# Altium project Tachometer-Board.PrjPcb
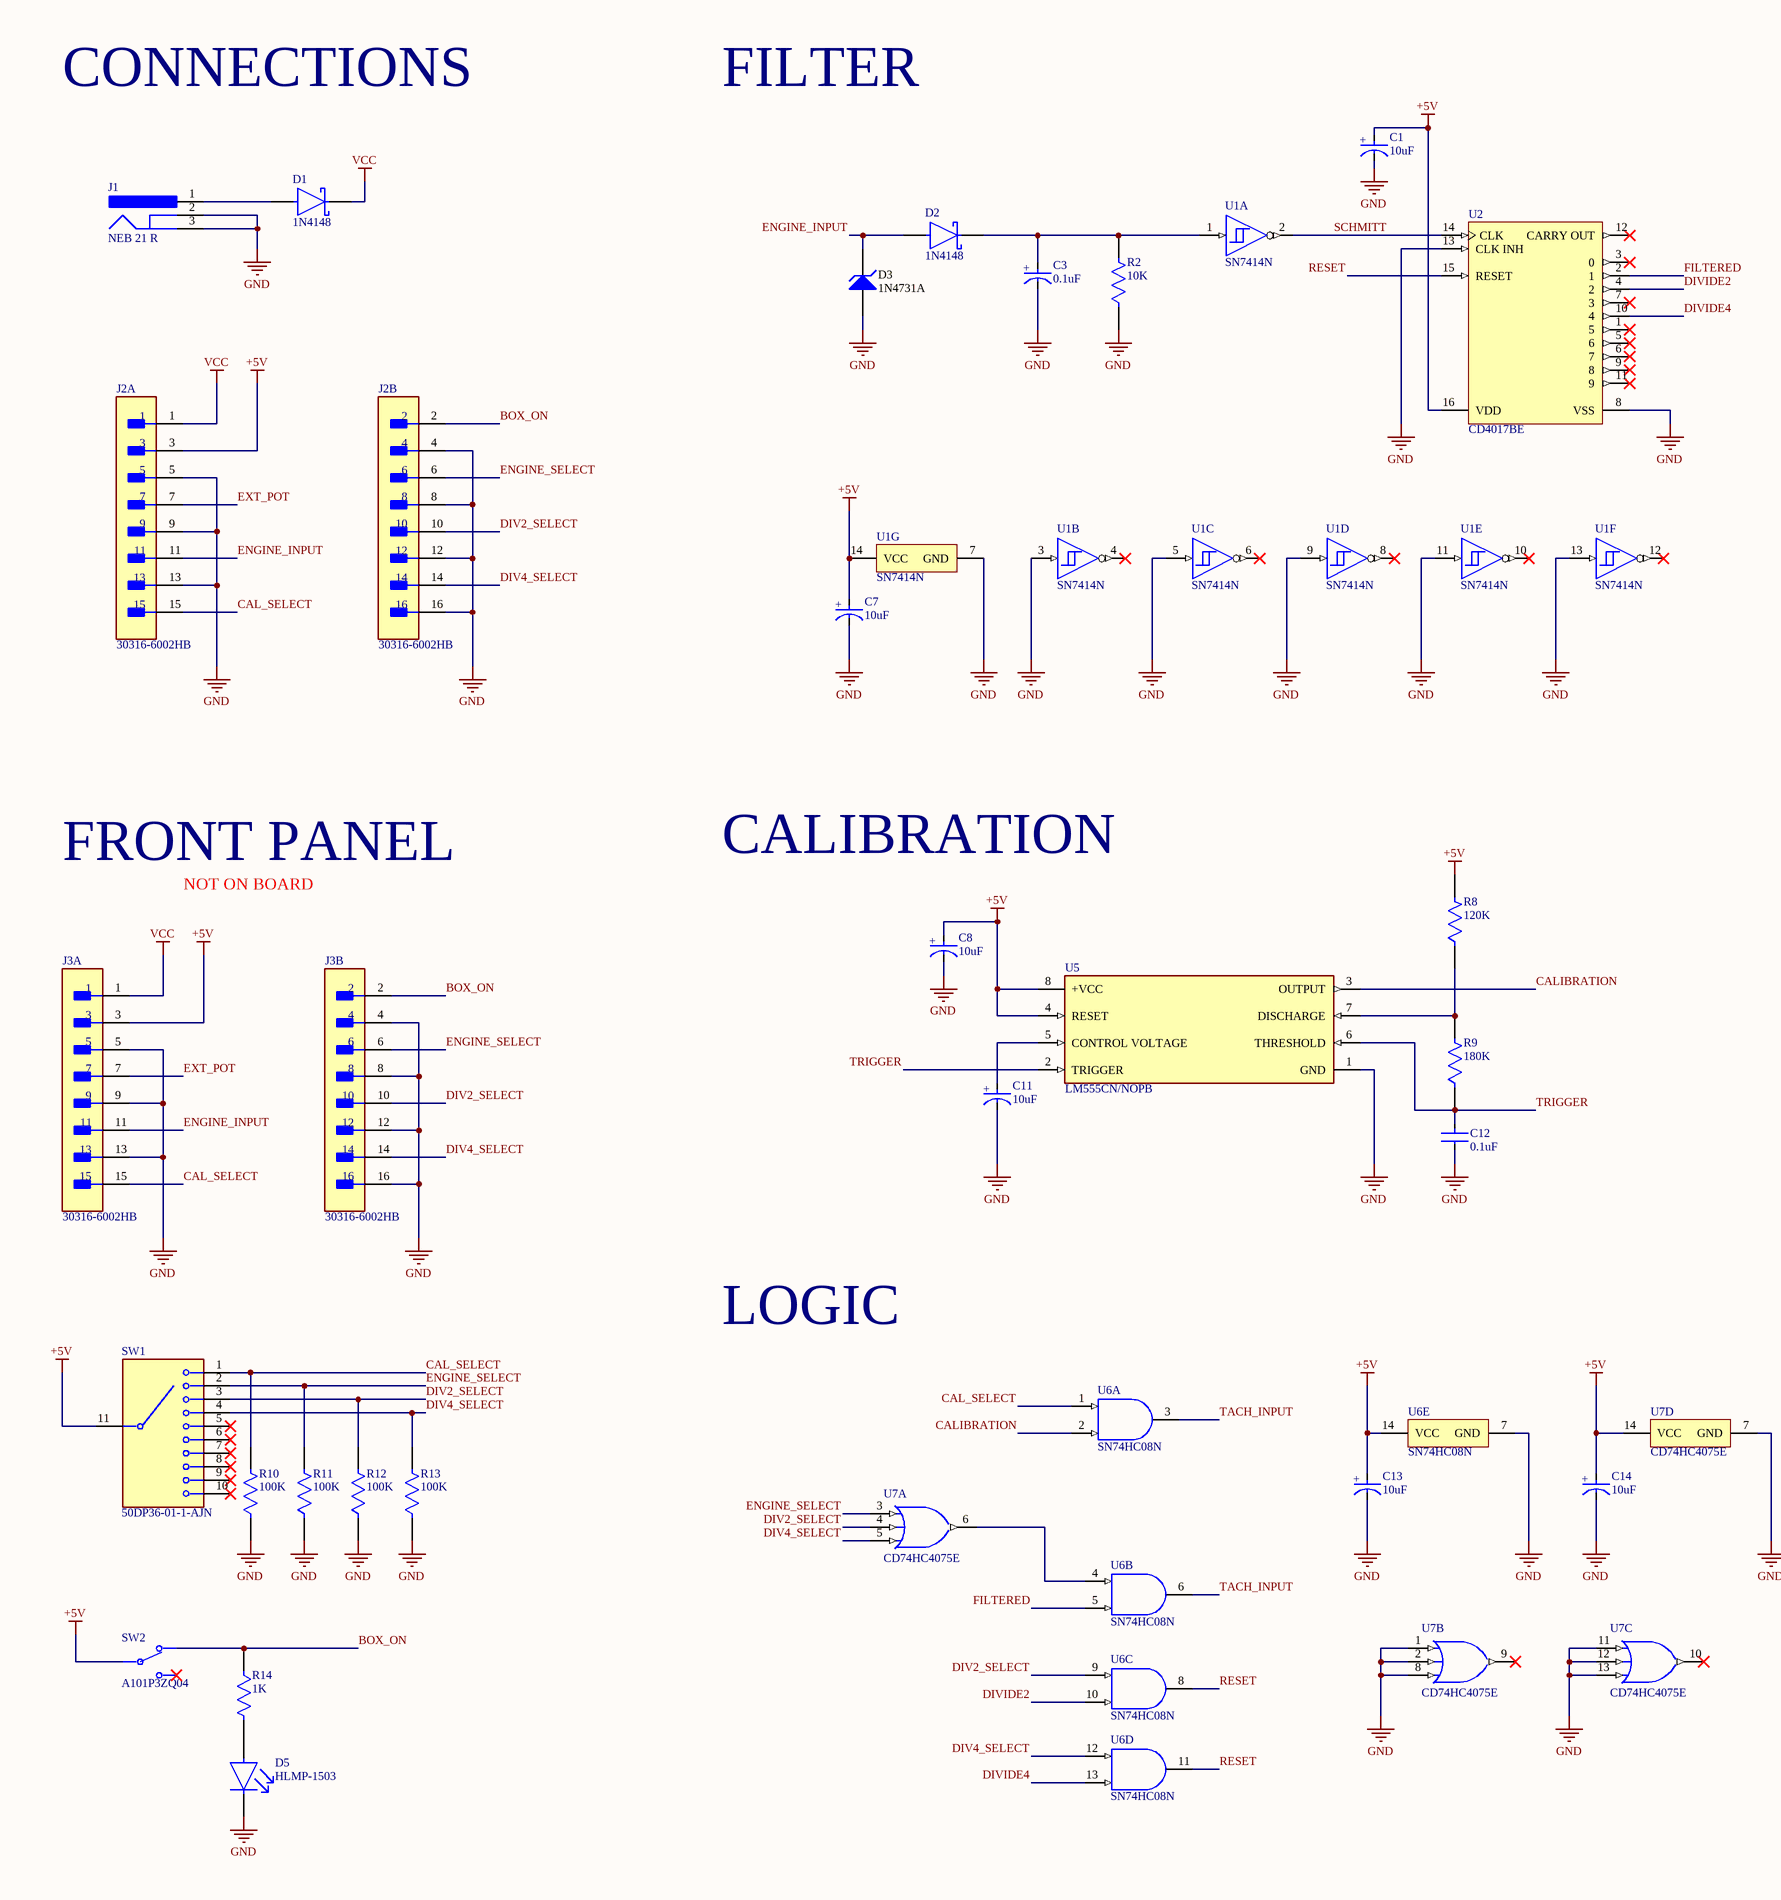
[diagram p0: Tachometer-Board.SchDoc, left]
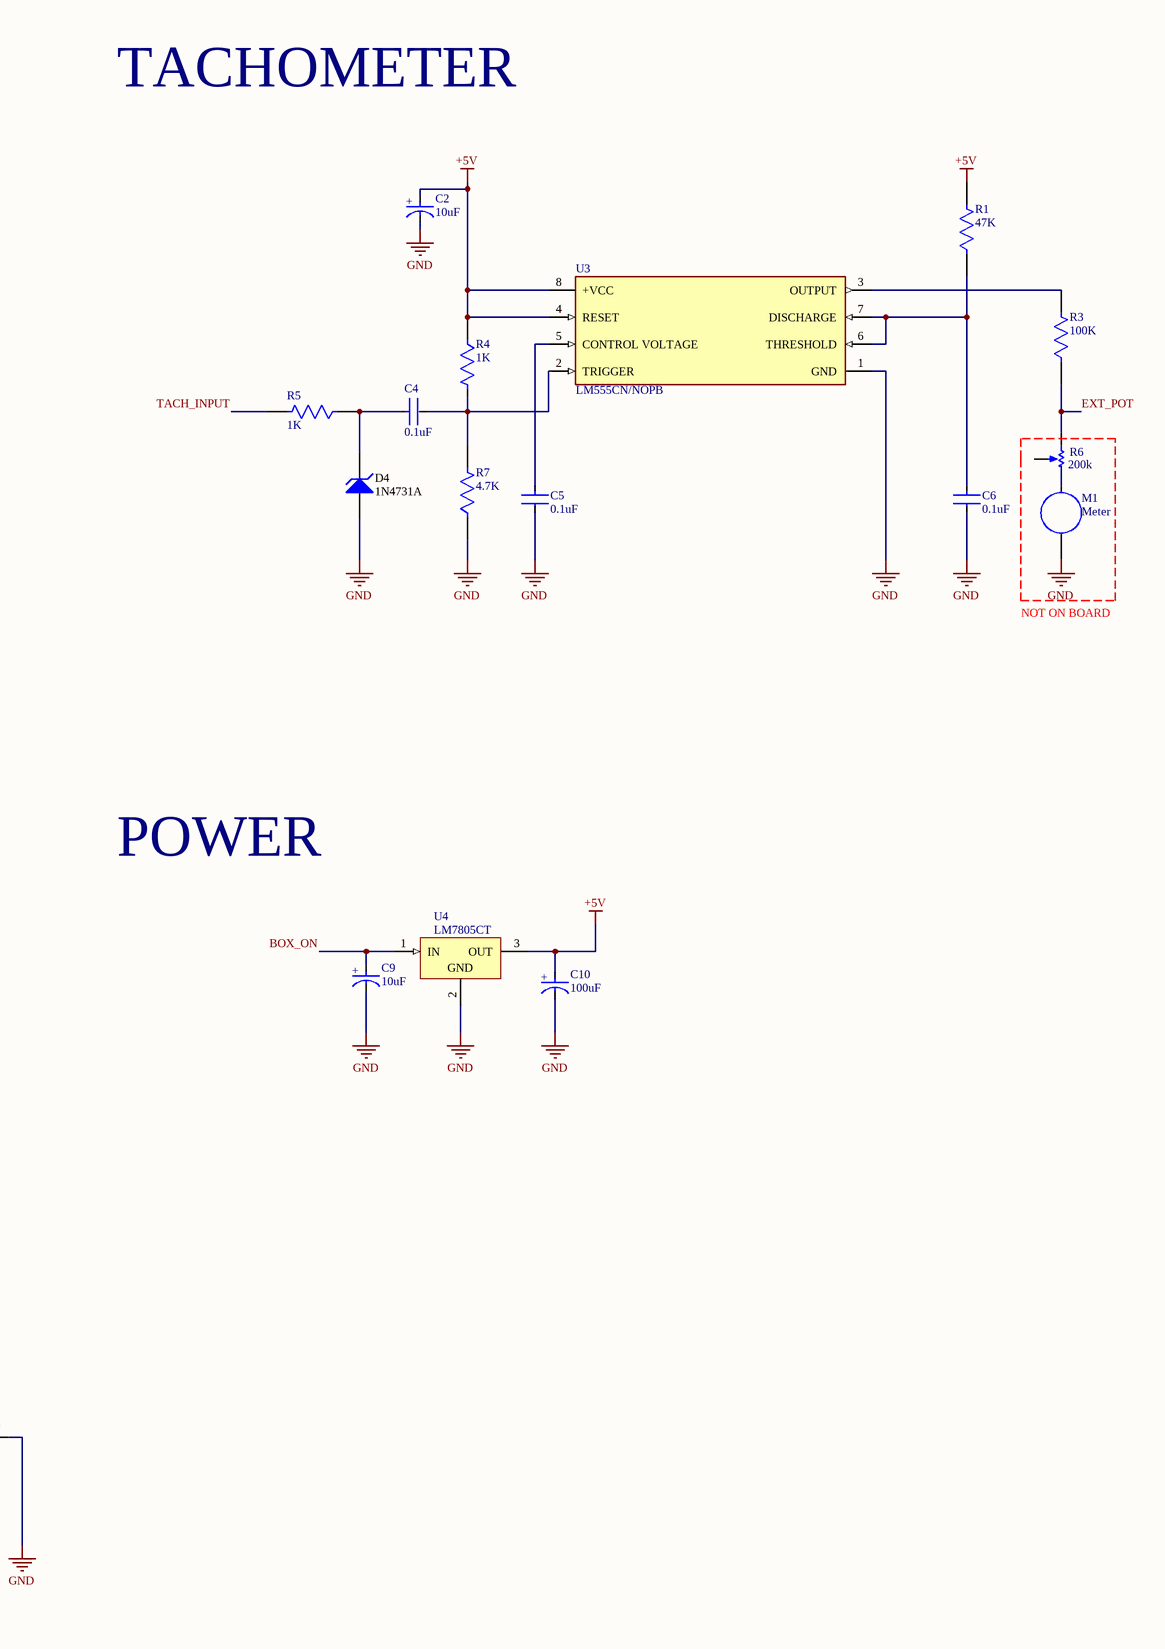
[diagram p1: Tachometer-Board.SchDoc, right]
1 sheet, 46 parts. Net scope: global (net labels, ports and power ports of the same name join across sheets).
Board files: Tachometer-BoardV2.PcbDoc, Tachometer-Board.PcbDoc

## Sheet Tachometer-Board.SchDoc
size A2; SheetNumber: 1; SheetTotal: 1

### Parts
C1  10uF  [FP-ESLE3-MFG]
C2  10uF  [FP-ESLE3-MFG]
C3  0.1uF  [FP-ESLE3-MFG]
C4  0.1uF  [FP-K15H5-MFG]
C5  0.1uF  [FP-K15H5-MFG]
C6  0.1uF  [FP-K15H5-MFG]
C7  10uF  [FP-ESLE3-MFG]
C8  10uF  [FP-ESLE3-MFG]
C9  10uF  [FP-ESLE3-MFG]
C10  100uF  [FP-ZLG6_3X7-MFG]
C11  10uF  [FP-ESLE3-MFG]
C12  0.1uF  [FP-K15H5-MFG]
C13  10uF  [FP-ESLE3-MFG]
C14  10uF  [FP-ESLE3-MFG]
D1  1N4148  [FP-DO-201AD-MFG]
D2  1N4148  [FP-DO-201AD-MFG]
D3  1N4731A  [FAIR-DO-41-2_V]
D4  1N4731A  [FAIR-DO-41-2_V]
D5  HLMP-1503  [FP-HLMP-1503-MFG]  (mechanical)
J1  NEB 21 R  [LUMB-NEB21R_V]
J2  30316-6002HB  [FP-30316-6002HB-MFG]  (parts A,B of 2)
J3  30316-6002HB  [FP-30316-6002HB-MFG]  (parts A,B of 2)  (mechanical)
M1  Meter  [RAD-0.1]  (mechanical)
R1  47K  [FP-MFR-25-MFG]
R2  10K  [FP-MFR-25-MFG]
R3  100K  [FP-MFR-25-MFG]
R4  1K  [FP-MFR-25-MFG]
R5  1K  [FP-MFR-25-MFG]
R6  value 200k  [VR5]  (hidden comment: RPot)  (mechanical)
R7  4.7K  [FP-MFR-25-MFG]
R8  120K  [FP-MFR-25-MFG]
R9  180K  [FP-MFR-25-MFG]
R10  100K  [FP-MFR-25-MFG]  (mechanical)
R11  100K  [FP-MFR-25-MFG]  (mechanical)
R12  100K  [FP-MFR-25-MFG]  (mechanical)
R13  100K  [FP-MFR-25-MFG]  (mechanical)
R14  1K  [FP-MFR-25-MFG]  (mechanical)
SW1  50DP36-01-1-AJN  [FP-50DP36-01-1-AJN-MFG]  (mechanical)
SW2  A101P3ZQ04  [FP-A101P3ZQ04-MFG]  (mechanical)
U1  SN7414N  [N0014A]  (parts A,B,C,D,E,F,G of 7)
U2  CD4017BE  [N0016A]
U3  LM555CN/NOPB  [FP-P0008A-MFG]
U4  LM7805CT  [FAIR-TO-220-3]
U5  LM555CN/NOPB  [FP-P0008A-MFG]
U6  SN74HC08N  [N0014A]  (parts A,B,C,D,E of 5)
U7  CD74HC4075E  [N0014A]  (parts A,B,C,D of 4)

### Nets
+5V: C1.2(A) C2.2(A) C7.2(A) C8.2(A) C10.2(A) C13.2(A) C14.2(A) J2.3 J3.3 R1.2 R4.1 R8.2 SW1.11(COMMON) U1.14(VCC) U2.16(VDD) U3.4(RESET) U3.8(+VCC) U4.3(OUT) U5.4(RESET) U5.8(+VCC) U6.14(VCC) U7.14(VCC)
GND: C1.1(C) C2.1(C) C3.1(C) C5.2 C6.2 C7.1(C) C8.1(C) C9.1(C) C10.1(C) C11.1(C) C12.2 C13.1(C) C14.1(C) D3.1(A) D4.1(A) D5.1(C) J1.2 J1.3 J2.4 J2.5 J2.8 J2.9 J2.12 J2.13 J2.16 J3.4 J3.5 J3.8 J3.9 J3.12 J3.13 J3.16 M1.1 R2.1 R7.1 R10.1 R11.1 R12.1 R13.1 U1.3(2A) U1.5(3A) U1.7(GND) U1.9(4A) U1.11(5A) U1.13(6A) U2.8(VSS) U2.13(CLK_INH) U3.1(GND) U4.2(GND) U5.1(GND) U6.7(GND) U7.1(2A) U7.2(2B) U7.7(GND) U7.8(2C) U7.11(3A) U7.12(3B) U7.13(3C)
VCC: D1.1(C) J2.1 J3.1
BOX_ON: C9.2(A) J2.2 J3.2 R14.1 U4.1(IN)
CAL_SELECT: J2.15 J3.15 R10.2 SW1.1 U6.1(1A)
CALIBRATION: U5.3(OUTPUT) U6.2(1B)
DIV2_SELECT: J2.10 J3.10 R12.2 SW1.3 U6.9(3A) U7.4(1B)
DIV4_SELECT: J2.14 J3.14 R13.2 SW1.4 U6.12(4A) U7.5(1C)
DIVIDE2: U2.4(2) U6.10(3B)
DIVIDE4: U2.10(4) U6.13(4B)
ENGINE_INPUT: D2.2(A) D3.2(K) J2.11 J3.11
ENGINE_SELECT: J2.6 J3.6 R11.2 SW1.2 U7.3(1A)
EXT_POT: J2.7 J3.7 R3.1 R6.1(TOP)
FILTERED: U2.2(1) U6.5(2B)
RESET: U2.15(RESET) U6.8(3Y) U6.11(4Y)
SCHMITT: U1.2(~{1Y}) U2.14(CLK)
TACH_INPUT: R5.2 U6.3(1Y) U6.6(2Y)
TRIGGER: C12.1 R9.1 U5.2(TRIGGER) U5.6(THRESHOLD)
NetC3_2: C3.2(A) D2.1(C) R2.2 U1.1(1A)
NetC4_1: C4.1 D4.2(K) R5.1
NetC4_2: C4.2 R4.2 R7.2 U3.2(TRIGGER)
NetC5_1: C5.1 U3.5(CONTROL_VOLTAGE)
NetC6_1: C6.1 R1.1 U3.6(THRESHOLD) U3.7(DISCHARGE)
NetC11_2: C11.2(A) U5.5(CONTROL_VOLTAGE)
NetD1_2: D1.2(A) J1.1
NetM1_2: M1.2 R6.2(BOT)
NetR3_2: R3.2 U3.3(OUTPUT)
NetR8_1: R8.1 R9.2 U5.7(DISCHARGE)
NetU6_4: U6.4(2A) U7.6(1Y)

Not connected (* = marked no-connect by the designer): D5 2(A); R6 3(TAP); R14 2; SW1 5* 6* 7* 8* 9* 10*; U1 4(~{2Y})* 6(~{3Y})* 8(~{4Y})* 10(~{5Y})* 12(~{6Y})*; U2 1(5)* 3(0)* 5(6)* 6(7)* 7(3)* 9(8)* 11(9)* 12(CARRY_OUT)*; U7 9(2Y)* 10(3Y)*

### Notes on the sheet
- CONNECTIONS
- FILTER
- TACHOMETER
- NOT ON BOARD
- FRONT PANEL
- CALIBRATION
- POWER
- LOGIC
- (in symbol CMP-03015-000004-1) +
- (in symbol CMP-35376-000006-1) +

### Library data of the parts
C1-C3 C7-C9 C11 C13 C14 = CMP-03015-000004-1: CAP ALUM 10UF 20% 100V THRU HOLE; Manufacturer Part Number: ESL106M100AE3AA; Manufacturer: kemet; Life: 10000Hours; Ripple Current: 280mA; Dissipation Factor: 9%; Esr: 0.68Ω; Leakage Current: 10uA; Material: Aluminum; Tolerance: 20%; Voltage Rating: 100V; Device Class L3: Aluminum Electrolytic Capacitors; Value: 10uF; Height: 12.5mm; Temperature Range High: +105°C; Capacitance: 10uF; ComponentLink2Description: Datasheet; Mouser Description: Cap, 10UF, 100V, Alu Elec, Radial; Category: Cap; Octopart: https://octopart.com/esl106m100ae3aa-kemet-84758885; Temperature: -40°C to +105°C; RoHS: TRUE; Device Class L1: Passive Components; Digikey Description: CAP ALUM 10UF 20% 100V THRU HOLE; ComponentLink2URL: https://content.kemet.com/datasheets/KEM_A4074_ESL.pdf; Device Class L2: Capacitors; Temperature Range Low: -40°C; Package: ESLE3; Automotive: No; Lead Free: Yes
C4-C6 C12 = CMP-02417-000048-1: CAP CER 0.1UF 50V X7R RADIAL; Capacitance: 100nF; Tolerance: 10%; Lead/Base Style: Formed Leads; Lead Length: 30mm; Lead Diameter: 0.5mm; Radiation Hardening: No; Lead Pitch: 5mm; Voltage: 50V; Mount: Through Hole; Package Quantity: 5000; Series: K; Case/Package: Dipped; Min Operating Temperature: -55°C; Depth: 2.5mm; Height - Seated (Max): 0.1inch; Voltage Rating (DC): 50V; Packaging: Bulk; RoHS Compliant: Yes; Construction: RADIAL; Thickness: 2.6mm; Max Operating Temperature: 125°C; Voltage Rating: 50V; Diameter: 500um; Dielectric: X7R; Width: 2.5mm; Length: 4mm; Weight: 0.005644oz; Termination: Radial; Height: 4mm
C10 = CMP-35376-000006-1: CAP ALUM 100UF 20% 10V RADIAL; Manufacturer Part Number: 10ZLG100MEFC6.3X7; Manufacturer: Rubycon; Leakage Current: 30uA; Dissipation Factor: 19%; Material: Aluminum; Life: 1000Hours; Ripple Current: 480mA; Temperature Range Low: -40°C; Capacitance: 100uF; Digikey Description: CAP ALUM 100UF 20% 10V RADIAL; Automotive: No; ComponentLink2Description: Datasheet; Device Class L2: Capacitors; Temperature: -40°C to +105°C; Octopart: https://octopart.com/10zlg100mefc6.3x7-rubycon-19991480; Temperature Range High: +105°C; Value: 100uF; Tolerance: 20%; RoHS: TRUE; Device Class L3: Aluminum Electrolytic Capacitors; Package: ZLG6.3X7; Lead Free: Yes; Category: Cap; Height: 8mm; Voltage Rating: 10V; ComponentLink2URL: http://www.rubycon.co.jp/en/catalog/e_pdfs/aluminum/e_zlg.pdf; Device Class L1: Passive Components
D1 D2 = CMP-12187-000025-1: DIODE SCHOTTKY 40V 3A DO201AD; Manufacturer Part Number: 1N5822; Manufacturer: STMicroelectronics; Max Junction Temp: +150°C; Peak Reverse Current: 2mA; Max Surge Forward Current: 80A; Temperature Range High: +150°C; Automotive: No; RoHS: TRUE; ComponentLink2Description: Datasheet; Lead Free: Yes; Octopart: https://octopart.com/1n5822-stmicroelectronics-323225; Device Class L2: Diodes; Max Repetitive Reverse Voltage: 40V; Temperature: to +150°C; Height: 5.3mm; Category: Diode; Digikey Description: DIODE SCHOTTKY 40V 3A DO201AD; ComponentLink2URL: https://www.st.com/resource/en/datasheet/1n5822.pdf; Device Class L3: Schottky Diodes; Device Class L1: Discrete Semiconductors; Forward Current: 3A; Mouser Description: Schottky Diodes & Rectifiers Vr/40V Io/3A BULK; Package: DO-201AD
D3 D4 = CMP-0892-00031-1: Zener Diode, 4.3V, 1W, 5%, -65 to 200 degC, 2-Pin DO-41, Body 2.72 x 5.2 mm, RoHS; Manufacturer: Fairchild Semiconductor; VZ (Max.) (V): 4.515; VZ (Min.) (V): 4.085; PD (W): 1; Test Current IZ (mA): 58; IR (uA): 10; ZZ (Max) (ohm): 9; ComponentLink3Description: Package Specification; ComponentLink2URL: http://www.fairchildsemi.com/ds/1N/1N4744A.pdf; ComponentLink3URL: http://www.fairchildsemi.com/dwg/DO/DO41A.pdf; PackageVersion: Rev. 2; PackageDescription: 2-Pin Axial leaded, Body 2.72 x 5.2 mm, Lead Spread 25.4 mm; ComponentLink2Description: Datasheet; PackageReference: DO-41-2; Mounting Technology: Through Hole; PartNumber: 1N4731A; ComponentLink1URL: http://www.fairchildsemi.com/; ComponentLink1Description: Manufacturer URL; RoHS: TRUE; Tolerance: 5%; DatasheetVersion: Rev. H3; Operating and Storage Temperature Range: -65 to 200 degC
D5 = CMP-18399-000010-1: LED GREEN DIFFUSED T-1 T/H; Manufacturer: Broadcom; Reverse Voltage: 5V; Wavelength: 569nm; Forward Voltage: 2.1V; Led Orientation: Straight; Viewing Angle: 60°; Max Junction Temp: +110°C; Peak Emmision Wavelength: 565nm; Luminous Intensity: 1mcd; Standoff Height: 0.88mm; Forward Current: 10mA; Mouser Description: LED; Green; 1mcd; 0.115In.Dia.; T-1; 565nm; 25mA; 2.1V; 5V; GaP; -20degC; 100deg; ComponentLink2Description: Datasheet; Digikey Description: LED GREEN DIFFUSED T-1 T/H; Device Class L1: Optoelectronics; Device Class L3: unset; Automotive: No; Device Class L2: LEDs; Manufacturer Part Number: HLMP-1503; Category: Diode; Temperature Range Low: -20°C; Height: 6.35mm; RoHS: TRUE; Octopart: https://octopart.com/hlmp-1503-broadcom-71130371; Temperature: -20°C to +100°C; Lead Free: Yes; ComponentLink2URL: https://docs.broadcom.com/docs/AV02-1555EN; Package: HLMP-1503; Colour: Green; Temperature Range High: +100°C
J1 = CMP-2000-06841-1: Jack Socket, Body 14.5 x 9 mm, Height 11 mm, -20 to 70 degC, 3-Pin THD, RoHS, Bulk; Manufacturer: Lumberg; Body Orientation: RightAngle; Voltage Rating: 12Vdc; Current Rating: 3A; Maximum Operating Temperature: +70°C; Mounting Technology: ThroughHole; Termination Method: Solder; Package Description: 3-Pin Through Hole Device, Body 14.5 x 9 mm, Height 11 mm; Datasheet URL: https://datasheet.ciiva.com/11720/0900766b805694d6-11720273.pdf; Datasheet Version: 12/2004; Package Reference: NEB21R; Manufacturer URL: http://www.lumberg.com/; Plug/Socket: Socket; Mounting Type: ThroughHole; Minimum Operating Temperature: -20°C
J2 J3 = CMP-05379-000007-1: CONN HEADER VERT 16POS 2.54MM; Manufacturer: 3M; Number Of Contacts: 16; Current Rating: 1A; Conn Orientation: Straight; Conn Gender: Male; Standoff Height: 0.01inch; RoHS: TRUE; Automotive: No; Pitch: 2.54mm; Temperature Range High: +105°C; Contact Material: Gold,Nickel; Device Class L3: unset; Device Class L2: Headers and Wire Housings; ComponentLink2Description: Datasheet; Octopart: https://octopart.com/30316-6002hb-3m-653367; Height: 0.375inch; Temperature: -55°C to +105°C; Category: Conn; Lead Free: Yes; Manufacturer Part Number: 30316-6002HB; Mouser Description: Conn Shrouded Header (4 Sides) HDR 16 POS 2.54mm Solder ST Thru-Hole Box; Package: 30316-6002HB; Temperature Range Low: -55°C; ComponentLink2URL: https://multimedia.3m.com/mws/media/22504O/3mtm-100-in-loprof-hdr-100x-100strt-ra-4-wall-ts0818.pdf; Digikey Description: CONN HEADER VERT 16POS 2.54MM; Device Class L1: Connectors; Number Of Rows: 2
M1 = Meter: Indicating Instrument; Note: Place a "letter" into the symbol to show the function of the meter or instrument; Published: 24-Mar-1999; LatestRevisionDate: 17-Jul-2002; LatestRevisionNote: Re-released for DXP Platform.; PackageReference: RAD-0.1; Publisher: Altium Limited; PackageDescription: Radial Cap, Thru-Hole; 2 Leads; 0.1 in Pin Spacing
R1-R5 R7-R14 = CMP-03413-000001-1: RES 1.18K OHM 1/4W 1% AXIAL; Manufacturer: Yageo; Manufacturer Part Number: MFR-25FBF52-1K18; Value: 1.18kΩ; Temperature Coefficient: 100ppm/°C; Power Rating: 0.25W; Voltage Rating: 250V; Temperature: -55°C to +155°C; Automotive: No; Temperature Range High: +155°C; Mouser Description: Metal Film Resistors 1.18K OHM 1/4W 1%; Digikey Description: RES 1.18K OHM 1/4W 1% AXIAL; Lead Free: Yes; Tolerance: 1%; ComponentLink2Description: Datasheet; ComponentLink2URL: https://www.yageo.com/upload/media/product/products/datasheet/lr/Yageo_LR_MFR_1.pdf; Temperature Range Low: -55°C; Package: MFR-25; Ipc Land Pattern Name: RESAD1000W75L680D260; Composition: Metal Film; Category: Res; Octopart: https://octopart.com/mfr-25fbf52-1k18-yageo-56251681; Series: MFR; Device Class L2: Resistors; Height: 2.6mm; Resistance: 1.18kΩ; Device Class L3: Through-Hole Resistors; RoHS: TRUE; Device Class L1: Passive Components
R6 = RPot: Potentiometer; Sim Note: Enter the Resistance value and the set point into parameter fields.; Set Position: 0.5; Published: 8-Jun-2000; LatestRevisionDate: 17-Jul-2002; LatestRevisionNote: Re-released for DXP Platform.; PackageReference: VR5; Publisher: Altium Limited; PackageDescription: Variable Resistor, Thru-Hole; 3 Leads
SW1 = CMP-31946-000001-1: SWITCH ROTARY 2-10POS 150MA 115V; Number of Decks: 1; Throw Configuration: SP; Number of Positions: 16; Max Voltage Rating (DC): 28V; Contact Resistance: 10mR; Contact Style: Non-Shorting; Index Angle: 36°; Max Current Rating: 200mA; Max Voltage Rating (AC): 220V; Actuator Length: 9.53mm; Index Stops: Adjustable; Actuator Material: Stainless Steel; Actuator Type: Shaft; Housing Material: Thermoset; Lead Free: Lead Free; Termination: PC Pins; Contact Material: Gold; Number of Poles: 1; Contact Plating: Gold; Orientation: Straight; Diameter: 12.7mm; Length: 12.7mm; Mount: Through Hole; Radiation Hardening: No; Number of Poles per Deck: 1; Packaging: Bulk; Series: 50; Voltage Rating (AC): 115V; RoHS Compliant: Yes; Number of Pins: 10; Current Rating: 200mA; Depth: 12.7mm; Voltage Rating (DC): 28V
SW2 = CMP-03408-000013-1: SWITCH TOGGLE SPDT 5A 120V; Contact Resistance: 1R; Voltage Rating (DC): 28V; Electrical Life: 30000Cycles; Actuator Type: Lever; Voltage Rating (AC): 250V; Number of Positions: 2; Actuator Length: 5.08mm; Switch Function: On-On; Illumination Type: Non-Illuminated; Number of Poles: 1; Max Operating Temperature: 85°C; Current Rating: 5A; Contact Current Rating: 5A; Throw Configuration: SPDT; Packaging: Bulk; Package Quantity: 100; Min Operating Temperature: -20°C; Termination: Lug; Series: Gemini A; Contact Plating: Silver; RoHS Compliant: Yes; Mount: Panel
U1 = CMP-1615-00881-3: Hex schmitt-trigger inverters, N0014A, TUBE; Manufacturer: Texas Instruments; Generic Part Number: SN7414; VCC(Max)(V): 5.25; VCC(Min)(V): 4.75; ICC @ Nom Voltage(Max)(mA): 0.06; Output Drive (IOL/IOH)(Max)(mA): -0.8/16; Input Type: TTL; F @ Nom Voltage(Max)(Mhz): 35; Voltage(Nom)(V): 5; Schmitt Trigger: Yes; Rating: Catalog; tpd @ Nom Voltage(Max)(ns): 22; Output Type: CMOS; Bits(#): 6; Operating Temperature Range(C): 0 to 70; DatasheetVersion: SDLS049B; Technology Family: TTL; PackageReference: N0014A; Code_JEDEC: MS-001
U2 = CMP-1623-00541-2: CMOS Decade Counter with 10 Decoded Outputs, N0016A, TUBE; Manufacturer: Texas Instruments; Schmitt Trigger: No; VCC(Max)(V): 18; tpd @ Nom Voltage(Max)(ns): 270; ICC @ Nom Voltage(Max)(mA): 0.03; Output Drive (IOL/IOH)(Max)(mA): 1.5/-1.5; VCC(Min)(V): 3; F @ Nom Voltage(Max)(Mhz): 8; Rating: Military; Technology Family: CD4000; Bits(#): 10; Inputs: 1; Type: Decade; Operating Temperature Range(C): -55 to 125; Output Type: CMOS; Code_JEDEC: MS-001; Function: Counter; PackageReference: N0016A; DatasheetVersion: SCHS027C; Input Type: CMOS; Generic Part Number: CD4017B; Voltage(Nom)(V): 10
U3 U5 = CMP-0056-00016-4: IC OSC SINGLE TIMER 100KHZ 8-DIP; Manufacturer: Texas Instruments; Min Supply Voltage: 4.5V; Standoff Height: 0.51mm; Number Of Timers/Counters: 1; Max Supply Voltage: 16V; Max Junction Temp: +70°C; Nominal Supply Current: 3mA; ComponentLink2Description: Datasheet; Category: IC; Manufacturer Part Number: LM555CN/NOPB; Digikey Description: IC OSC SINGLE TIMER 100KHZ 8-DIP; Ambient Temperature Range High: +70°C; Automotive: No; Device Class L3: Timers and Oscillators; Device Class L1: Integrated Circuits (ICs); Temperature Range High: +70°C; Lead Free: Yes; ComponentLink2URL: http://www.ti.com/lit/ds/symlink/lm555.pdf; Octopart: https://octopart.com/lm555cn%2Fnopb-texas+instruments-24814897; RoHS: TRUE; Ambient Temperature Range Low: 0°C; Temperature Range Low: 0°C; Package: P0008A; Temperature: 0°C to +70°C; Height: 5.08mm; Device Class L2: Clock and Timing
U4 = CMP-2000-04938-1: Positive Voltage Regulator, 5 V, 1 A, -40 to 125 degC, 3-Pin TO-220, RoHS, Tube; Manufacturer: FairchildSemiconductor; Maximum Input Voltage: 35V; Maximum Quiescent Current: 8mA; Load Regulation: 100mV; Maximum Output Current: 2.2(Typ)A; Output Type: Fixed; Typical Dropout Voltage @ Current: 2@1AV; Rad Hard: No; Output Voltage: 5V; Accuracy: ±4%; Number of Outputs: 1; Category: LinearRegulator; Package Description: 3-Pin Through Hole Device, Body 10 x 4.5 mm, Pitch 2.54 mm; Packaging: Rail/Tube; Mounting: ThroughHole; Polarity: Positive; Manufacturer URL: https://www.fairchildsemi.com/; Line Regulation: 100mV; Datasheet Version: Aug-12; Datasheet URL: https://datasheet.ciiva.com/26904/lm7805ct-26904988.pdf; Package Reference: TO-220; Package URL: https://www.fairchildsemi.com/package-drawings/TO/TO220B03.pdf; Package: 3TO-220AB; Operating Temperature: -40to125degC; Type: Linear
U6 = CMP-0777-00250-3: Quadruple 2-Input Positive-AND Gates, N0014A, TUBE; Manufacturer: Texas Instruments; Output Type: CMOS; ICC @ Nom Voltage(Max)(mA): 0.02; tpd @ Nom Voltage(Max)(ns): 28; Voltage(Nom)(V): 5; VCC(Min)(V): 2; Technology Family: HC; F @ Nom Voltage(Max)(Mhz): 70; Rating: Catalog; Bits(#): 4; Schmitt Trigger: No; VCC(Max)(V): 6; PackageReference: N0014A; Input Type: CMOS; Generic Part Number: SN74HC08; DatasheetVersion: SCLS081F; Operating Temperature Range(C): -40 to 85
U7 = CMP-1573-00141-3: High Speed CMOS Logic Triple 3-Input OR Gates, N0014A, TUBE; Manufacturer: Texas Instruments; Rating: Catalog; VCC(Max)(V): 6; Bits(#): 3; Output Drive (IOL/IOH)(Max)(mA): 5.2/-5.2; tpd @ Nom Voltage(Max)(ns): 25; ICC @ Nom Voltage(Max)(mA): 0.02; Voltage(Nom)(V): 5; VCC(Min)(V): 2; F @ Nom Voltage(Max)(Mhz): 70; Generic Part Number: CD74HC4075; Code_JEDEC: MS-001; PackageReference: N0014A; Input Type: CMOS; DatasheetVersion: SCHS210G; Operating Temperature Range(C): -55 to 125; Output Type: CMOS; PackageVersion: http://www.ti.com/lit/ml/mpdi002c/mpdi002c.pdf